# Altium schematic sheet Sheet2.SchDoc: Sense Stage
size Tabloid; DocumentNumber: LM-002; Revision: A; SheetNumber: 2; SheetTotal: 2; DocumentName: LM-002
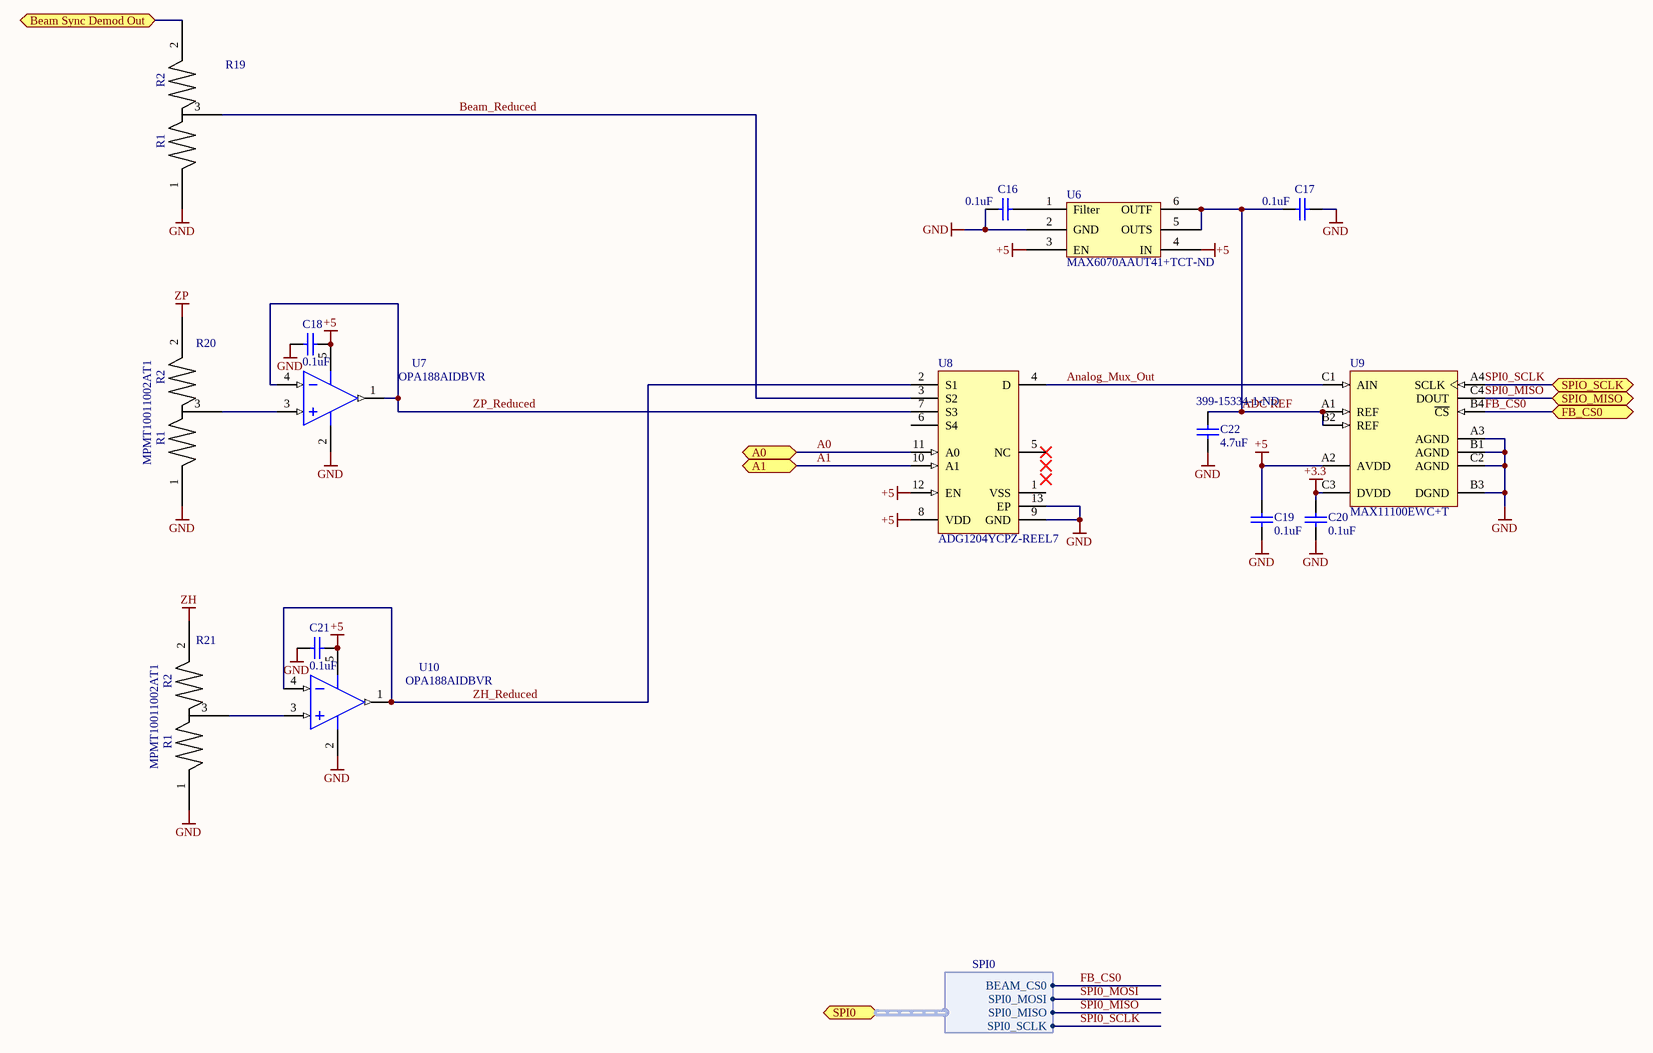
[diagram p0: Sheet2.SchDoc]

## Parts
C16  0.1uF  [CAPC0402(1005)60_L]
C17  0.1uF  [CAPC0402(1005)60_L]
C18  0.1uF  [CAPC0402(1005)60_L]
C19  0.1uF  [CAPC0402(1005)60_L]
C20  0.1uF  [CAPC0402(1005)60_L]
C21  0.1uF  [CAPC0402(1005)60_L]
C22  4.7uF  Supplier Part Number 1: 399-15334-1-ND  [CAPC0402(1005)60_L]
R19  MPM  [SOT95P230X102-3N-MPM]  (value not drawn)
R20  MPMT10011002AT1  [SOT95P230X102-3N-MPM]
R21  MPMT10011002AT1  [SOT95P230X102-3N-MPM]
U6  Supplier Part Number 1: MAX6070AAUT41+TCT-ND  [SOT95P280X445-6N]  (hidden comment: MAX6070AAUT41+T)
U7  OPA188AIDBVR  [DBV0005A_M]
U8  ADG1204YCPZ-REEL7  [ADI-CP-12-1_L]
U9  MAX11100EWC+T  [W121A2+1]
U10  OPA188AIDBVR  [DBV0005A_M]

## Ports
A0, A1, Beam Sync Demod Out, FB_CS0, SPI0 (harness SPI0), SPIO_MISO, SPIO_SCLK

## Harnesses
SPI0: BEAM_CS0, SPI0_MOSI, SPI0_MISO, SPI0_SCLK

## Nets
+3.3: C20.1 U9.C3(DVDD)
+5: C18.2 C19.1 C21.2 U6.3(EN) U6.4(IN) U7.5(V+) U8.8(VDD) U8.12(EN) U9.A2(AVDD) U10.5(V+)
GND: C16.2 C17.1 C18.1 C19.2 C20.2 C21.1 C22.2 R19.1 R20.1 R21.1 U6.2(GND) U7.2(V-) U8.9(GND) U8.13(EP) U9.A3(AGND) U9.B1(AGND) U9.B3(DGND) U9.C2(AGND) U10.2(V-)
ZH: R21.2
ZP: R20.2
A0: U8.11(A0) ; port A0
A1: U8.10(A1) ; port A1
ADC REF: C17.2 C22.1 U6.5(OUTS) U6.6(OUTF) U9.A1(REF) U9.B2(REF)
Analog_Mux_Out: U8.4(D) U9.C1(AIN)
Beam Sync Demod Out: R19.2 ; port Beam Sync Demod Out
Beam_Reduced: R19.3 U8.3(S2)
FB_CS0: U9.B4(~{CS}) ; port FB_CS0, port SPI0.BEAM_CS0
SPI0_MISO: U9.C4(DOUT) ; port SPIO_MISO, port SPI0.SPI0_MISO
SPI0_MOSI: port SPI0.SPI0_MOSI
SPI0_SCLK: U9.A4(SCLK) ; port SPIO_SCLK, port SPI0.SPI0_SCLK
ZH_Reduced: U8.2(S1) U10.1(OUT) U10.4(IN-)
ZP_Reduced: U7.1(OUT) U7.4(IN-) U8.7(S3)
NetC16_1: C16.1 U6.1(Filter)
NetR20_3: R20.3 U7.3(IN+)
NetR21_3: R21.3 U10.3(IN+)

Not connected (* = marked no-connect by the designer): U8 1(VSS) 5(NC)* 6(S4)

## Notes on the sheet
- Title
- Size:
- Date:
- Tabloid
- Number:
- Time:
- Revision:
- Sheet
- of
- ZLS Corporation
- 7801 North Lamar Blvd.
- Suite E-184
- Austin, Texas 78752  USA
- (512) 453-0288
- File:
- (in symbol MPM) R2; R1

## Library data of the parts
C16-C21 = CMP-1034-00252-1: CAP CER 0.1UF 10V X7R 0402; Manufacturer: Murata Electronics North America; Manufacturer Part Number: GRM155R71A104KA01D; Tolerance: ±10%; Supplier 1: Digi-Key; Supplier Part Number 1: 490-6321-1-ND; RoHS: RoHS Compliant; Category: Capacitors; Stock 1: 2920395; Pricing 1: 1=0.1, 10=0.014, 100=0.0063, 500=0.00446, 1000=0.00351, 2500=0.00319, 5000=0.00293 (USD); Packaging: Cut Tape (CT); Part Status: Active; Voltage - Rated: 10V; Temperature Coefficient: X7R; Operating Temperature: -55°C ~ 125°C; Features: -; Ratings: -; Applications: General Purpose; Mounting Type: Surface Mount, MLCC; Package / Case: 0402 (1005 Metric); Size / Dimension: 0.039" L x 0.020" W (1.00mm x 0.50mm); Height - Seated (Max): -; Thickness (Max): 0.022" (0.55mm); Lead Spacing: -; ComponentLink1URL: http://www.murata.com/~/media/webrenewal/support/library/catalog/products/capacitor/mlcc/c02e.ashx?la=en-us; ComponentLink1Description: http://www.murata.com/~/media/webrenewal/support/library/catalog/products/capacitor/mlcc/c02e.ashx?la=en-us
C22 = CMP-1034-00252-1: CAP CER 4.7UF 10V X7R 0402; Manufacturer: KEMET; Manufacturer Part Number: C0402C479D4GAC7867; Description: CAP CER 4.7PF 16V NP0 0402; Tolerance: ±0.5pF; Voltage - Rated: 16V; Temperature Coefficient: C0G, NP0; Supplier 1: Digi-Key; RoHS: RoHS Compliant; Category: Capacitors; Stock 1: 19724; Pricing 1: 1=0.34, 10=0.235, 100=0.1333, 500=0.09412, 1000=0.08235, 2500=0.07843, 5000=0.07255 (USD); Packaging: Cut Tape (CT); Part Status: Active; Operating Temperature: -55°C ~ 125°C; Features: Low ESL; Ratings: -; Applications: General Purpose; Failure Rate: -; Mounting Type: Surface Mount, MLCC; Package / Case: 0402 (1005 Metric); Size / Dimension: 0.039" L x 0.020" W (1.00mm x 0.50mm); Height - Seated (Max): -; Thickness (Max): 0.022" (0.55mm); Lead Spacing: -; Lead Style: -; ComponentLink1URL: https://search.kemet.com/component-edge/download/datasheet/C0402C479D4GACTU.pdf; ComponentLink1Description: https://search.kemet.com/component-edge/download/datasheet/C0402C479D4GACTU.pdf
R20 R21 = MPM: RES NTWRK 2 RES MULT OHM TO236-3; Manufacturer: Vishay Thin Film; Circuit Type: Voltage Divider; Resistance (Ohms): 1k, 10k; Tolerance: ±0.1%; Power Per Element: 100mW; Temperature Coefficient: ±25ppm/°C; Supplier 1: Digi-Key; Supplier Part Number 1: MPMT-1K/10KCT-ND; Manufacturer Part Number: MPMT10011002AT1; RoHS: RoHS Compliant; Category: Resistors; Stock 1: 4892; Pricing 1: 1=4.18, 10=3.774, 25=3.4528, 50=3.212, 100=2.8105, 250=2.409, 500=2.20826 (USD); Packaging: Cut Tape (CT); Part Status: Active; Operating Temperature: -55°C ~ 125°C; Applications: Voltage Divider (TCR Matched); Mounting Type: Surface Mount; Package / Case: TO-236-3, SC-59, SOT-23-3; Supplier Device Package: SOT-23; Size / Dimension: 0.113" L x 0.051" W (2.86mm x 1.30mm); Height - Seated (Max): 0.040" (1.02mm); ComponentLink1URL: http://www.vishay.com/docs/60001/mpm.pdf; ComponentLink1Description: http://www.vishay.com/docs/60001/mpm.pdf
U6 = MAX6070AAUT41+T: IC VREF SERIES 4.096V SOT23; Manufacturer: Maxim Integrated; Output Type: Fixed; Tolerance: ±0.04%; Temperature Coefficient: 6ppm/°C; Noise - 0.1Hz to 10Hz: 9.6µVp-p; Noise - 10Hz to 10kHz: 9µVrms; Voltage - Input: 4.3 V ~ 5.5 V; Current - Supply: 350µA; Supplier 1: Digi-Key; Manufacturer Part Number: MAX6070AAUT41+T; RoHS: RoHS Compliant; Category: Integrated Circuits (ICs); Stock 1: 2623; Pricing 1: 1=3.41, 10=3.213, 25=2.5704, 50=2.4418, 100=2.2491, 250=2.13344, 500=2.05634 (USD); Packaging: Cut Tape (CT); Part Status: Active; Reference Type: Series; Voltage - Output (Min/Fixed): 4.096V; Operating Temperature: -40°C ~ 125°C (TA); Mounting Type: Surface Mount; Package / Case: SOT-23-6; Supplier Device Package: SOT-23-6; ComponentLink1URL: https://datasheets.maximintegrated.com/en/ds/MAX6070-MAX6071.pdf; ComponentLink1Description: https://datasheets.maximintegrated.com/en/ds/MAX6070-MAX6071.pdf
U7 U10 = CMP-0809-00005-2: Precision, Low Noise, Rail-to-Rail Output, Zero-Drift Operational Amplifier, 4 to 36 V, -40 to 125 degC, 5-pin SOT23 (DBV5), Green (RoHS & no Sb/Br); Manufacturer: Texas Instruments; Total Supply Voltage(Min)(+5V is 5, +/-5V is 10): 4; Offset Drift(Typ)(uV/C): 0.03; Rating: Catalog; SubFamily: Zero Drift Precision Amplifier; GBW(Typ)(MHz): 2; Slew Rate(Typ)(V/us): 0.8; Number of Channels: 1; CMRR(Min)(dB): 120; Iq per channel(Max)(mA): 0.51; Total Supply Voltage(Max)(+5V is 5, +/-5V is 10): 36; PartNumber: OPA188AIDBVR; ComponentLink2Description: Datasheet; ComponentLink2URL: http://www.ti.com/lit/ds/symlink/opa188.pdf; ComponentLink1Description: Manufacturer URL; Mounting Technology: Surface Mount; Eco-Plan: Green (RoHS & no Sb/Br); ComponentLink1URL: http://www.ti.com/; PackageVersion: 4073253-4/K, 03/2006; DatasheetVersion: SBOS642A; ComponentLink3Description: Package Specification; PackageReference: DBV0005A; ComponentLink3URL: http://www.ti.com/litv/pdf/mpds018i; PackageDescription: 5-Pin Plastic Small Outline, Body 1.6 x 2.9 mm, Pitch 0.95 mm; Code_JEDEC: MO-178
U8 = CMP-0793-00001-1: Low Capacitance, Low Charge Injection, +/-15 V / +12 V, 4:1 iCMOS Multiplexer, 120 Ohm Ron, 12-pin QFN (CP-12-1), Reel; Manufacturer: Analog Devices; Max Analog Signal Range: Vss to Vdd; Bandwidth (Hz): 800M, 550M; Ron (ohms): 120; t transition (s): 120n; ComponentLink2URL: http://www.analog.com/static/imported-files/data_sheets/ADG1204.pdf; ComponentLink3URL: http://www.analog.com/static/imported-files/packages/CP_12_1.pdf; Packing: Reel; PartNumber: ADG1204YCPZ-REEL7; ComponentLink1URL: http://www.analog.com/en/index.html; PackageReference: CP-12-1; Mounting Technology: Surface Mount; DatasheetVersion: Rev. B; ComponentLink3Description: Package Specification; ComponentLink1Description: Manufacturer URL; ComponentLink2Description: Datasheet; PackageDescription: 12-Pin Lead Frame Chip Scale Package, Body 3 x 3 mm, Pitch 0.5 mm; Code_JEDEC: MO-220-VEED-1
U9 = CMP-0249-00001-1: 16-Bit, +5V, 200ksps ADC with 10uA Shutdown, 12-Pin WLP, -40°C to +85°C, Pb-Free, Tape and Reel; PackageDescription: 12-Bump Wafer-Level Package (WLP) 3x4 Bump, Full Array, 0.5 mm Pitch, Pb-Free; PackageReference: W121A2+1; PackageVersion: revG, 2010; DatasheetVersion: Rev 1, Jan-2012; ComponentLink2Description: Datasheet; ComponentLink3URL: http://pdfserv.maxim-ic.com/package_dwgs/21-0009.PDF; ComponentLink2URL: http://datasheets.maxim-ic.com/en/ds/MAX11100.pdf; ComponentLink1Description: Manufacturer URL; ComponentLink3Description: Package Specification; ComponentLink1URL: http://www.maxim-ic.com